# EasyEDA schematic SCH_Fume-Extractor_2025-12-03.json
TITLE: Fume Extractor PCB; REV: 1.0; Date: 2025-12-03; Sheet: 1/1; Drawn By: Parth Dhingra; Company: Parth Dhingra
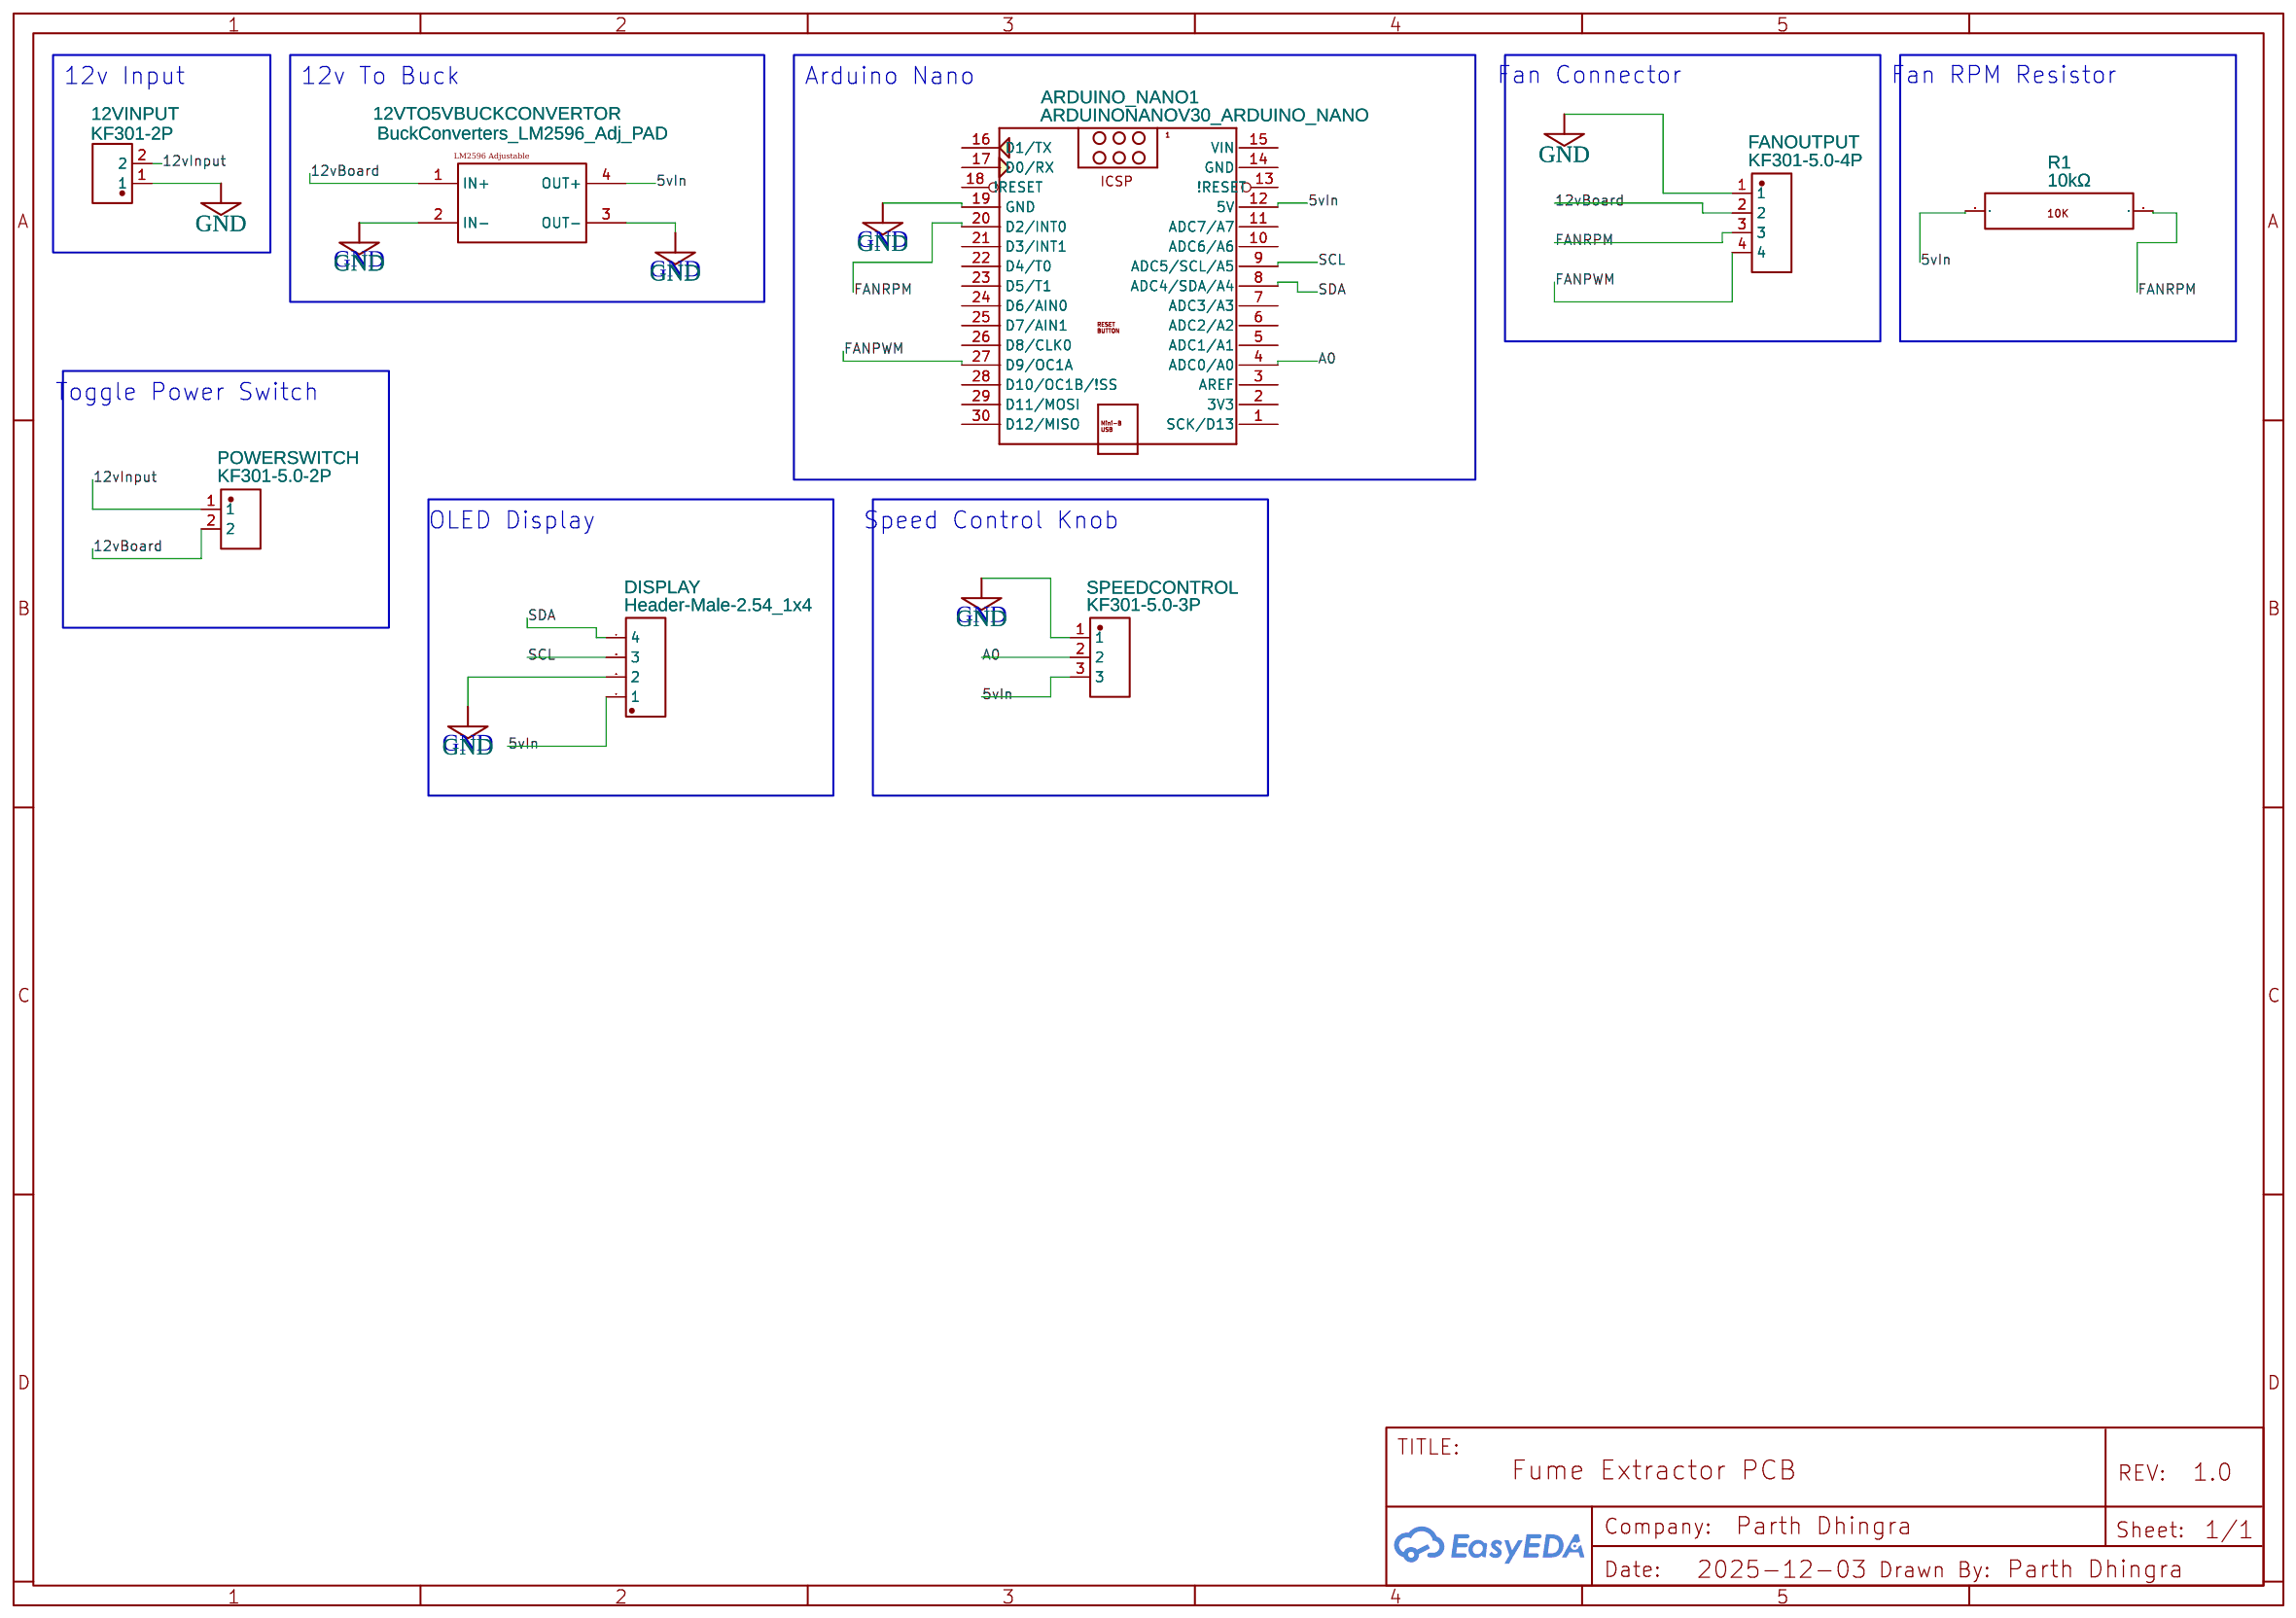
[diagram p0: schematic sheet]

## Parts
12VINPUT  KF301-2P  [CONN-TH_XY301V-A-5.0-2P]
12VTO5VBUCKCONVERTOR  BuckConverters_LM2596_Adj_PAD  [LM2596:YAAJ_DCDC_STEPDOWN_LM2596]
ARDUINO_NANO1  ARDUINONANOV30_ARDUINO_NANO  [ARDUINONANOV30_ARDUINO_NANO]
DISPLAY  Header-Male-2.54_1x4  [DIP-1X4P-2.54MM-M]
FANOUTPUT  KF301-5.0-4P  [KF301-5.0-4P]
POWERSWITCH  KF301-5.0-2P  [CONN-TH_P5.00_KF301-5.0-2P]
R1  10kΩ  [10K-OHM-RESISTOR]
SPEEDCONTROL  KF301-5.0-3P  [CONN-TH_3P-P5.00_KF301-5.0-3P]

## Library data of the parts
12VINPUT = KF301-2P接线端子: Supplier: LCSC; Supplier Part: C9900016950; Manufacturer: null; JLCPCB Part Class: Extended Part; Contributor: nghia.nguyen021001
12VTO5VBUCKCONVERTOR = BuckConverters_LM2596_Adj_PAD: Servo 5V; Symbol: BuckConverters_LM2596_Adj; Device: BuckConverters_LM2596_Adj; Add into BOM: Yes; Convert to PCB: Yes; Origin Footprint: YAAJ_DCDC_StepDown_LM2596; Comment: BuckConverters_LM2596_Adj; Contributor: razeed; Package Display: No
ARDUINO_NANO1 = ARDUINONANOV30_ARDUINO_NANO
DISPLAY = Header-Male-2.54_1x4: Supplier: LCSC; Manufacturer: Ckmtw; Manufacturer Part: 210S-1*4P L=11.6MMGold-plated black; Contributor: irukaict; Supplier Part: C124378
FANOUTPUT = KF301-5.0-4P: Contributor: LCSC; Supplier: LCSC; Supplier Part: C424682; Manufacturer: DORABO(地博电气); Manufacturer Part: DB128V-5.0-4P-GN-S; JLCPCB Part Class: Extended Part
POWERSWITCH = KF301-5.0-2P: Contributor: LCSC; Supplier: LCSC; Supplier Part: C474881; Manufacturer: KEFA(科发); JLCPCB Part Class: Extended Part
R1 = SYMBOL--XX--RESISTOR-1/4W-10K-1-PERCENT HJN: Supplier: LCSC; Supplier Part: C119347; Manufacturer: CCO(千志电子); Manufacturer Part: MF1/4W-10KΩ±1% T; Resistance (Ohms): 10K; Contributor: zuxo; JLCPCB Part Class: Extended Part
SPEEDCONTROL = KF301-5.0-3P: Contributor: LCSC; Supplier: LCSC; Supplier Part: C474882; Manufacturer: KEFA(科发); JLCPCB Part Class: Extended Part

## Nets
5vIn: 12VTO5VBUCKCONVERTOR.4(OUT+) ARDUINO_NANO1.12(5V) DISPLAY.1 R1.1 SPEEDCONTROL.3
12vBoard: 12VTO5VBUCKCONVERTOR.1(IN+) FANOUTPUT.2 POWERSWITCH.2
12vInput: 12VINPUT.2 POWERSWITCH.1
GND: 12VINPUT.1 12VTO5VBUCKCONVERTOR.2(IN-) 12VTO5VBUCKCONVERTOR.3(OUT-) ARDUINO_NANO1.19(GND) DISPLAY.2 FANOUTPUT.1 SPEEDCONTROL.1
A0: ARDUINO_NANO1.4(ADC0/A0) SPEEDCONTROL.2
FANPWM: ARDUINO_NANO1.27(D9/OC1A) FANOUTPUT.4
FANRPM: ARDUINO_NANO1.20(D2/INT0) FANOUTPUT.3 R1.2
SCL: ARDUINO_NANO1.9(ADC5/SCL/A5) DISPLAY.3
SDA: ARDUINO_NANO1.8(ADC4/SDA/A4) DISPLAY.4

Not connected (* = marked no-connect by the designer): ARDUINO_NANO1 1(SCK/D13) 2(3V3) 3(AREF) 5(ADC1/A1) 6(ADC2/A2) 7(ADC3/A3) 10(ADC6/A6) 11(ADC7/A7) 13(!RESET) 14(GND) 15(VIN) 16(D1/TX) 17(D0/RX) 18(!RESET) 21(D3/INT1) 22(D4/T0) 23(D5/T1) 24(D6/AIN0) 25(D7/AIN1) 26(D8/CLK0) 28(D10/OC1B/!SS) 29(D11/MOSI) 30(D12/MISO)

## Notes on the sheet
- 12v Input
- 12v To Buck
- Arduino Nano
- Fan Connector
- Fan RPM Resistor
- GND
- GND
- GND
- Toggle Power Switch
- OLED Display
- Speed Control Knob
- GND
- GND
